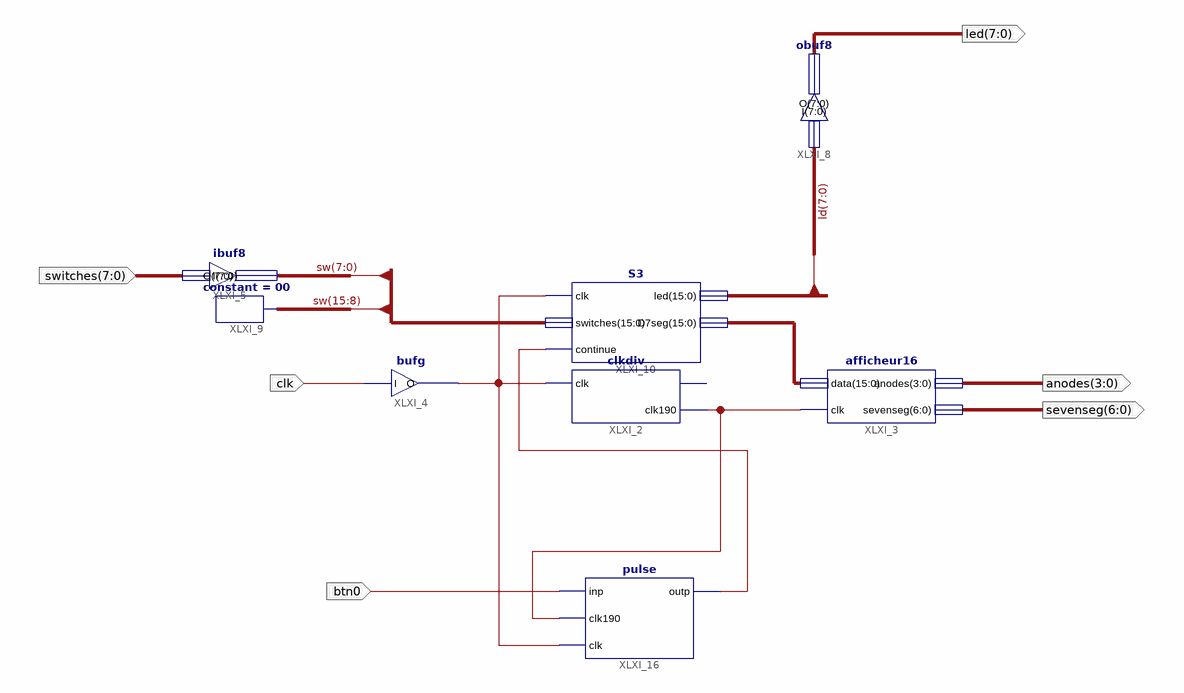
[diagram p0: schematic sheet 1]
// Xilinx ISE schematic toplevel.sch (spartan3e) as structural Verilog: 8 symbols, 6 ports
module toplevel (
  input  [7:0] switches,
  input  clk,
  input  btn0,
  output [7:0] led,
  output [6:0] sevenseg,
  output [3:0] anodes
);

  wire XLXN_5, XLXN_14, XLXN_16;
  wire [15:0] ld, sw, XLXN_2;

  ibuf8 XLXI_5 (.I(switches), .O(sw[7:0]));
  obuf8 XLXI_8 (.I(ld[7:0]), .O(led));
  constant #(.CValue("00")) XLXI_9 (.O(sw[15:8]));
  S3 XLXI_10 (.clk(XLXN_5), .switches(sw), .\continue (XLXN_14), .led(ld), .D7seg(XLXN_2));
  afficheur16 XLXI_3 (.data(XLXN_2), .clk(XLXN_16), .anodes(anodes), .sevenseg(sevenseg));
  bufg XLXI_4 (.I(clk), .O(XLXN_5));
  clkdiv XLXI_2 (.clk(XLXN_5), .clk190(XLXN_16));  // open: clksec
  pulse XLXI_16 (.inp(btn0), .clk190(XLXN_16), .clk(XLXN_5), .outp(XLXN_14));
endmodule
